# Altium project netv2mvp-dvt1.PrjPcb (part 2 of 2)

## Sheet 05io.SchDoc
size C
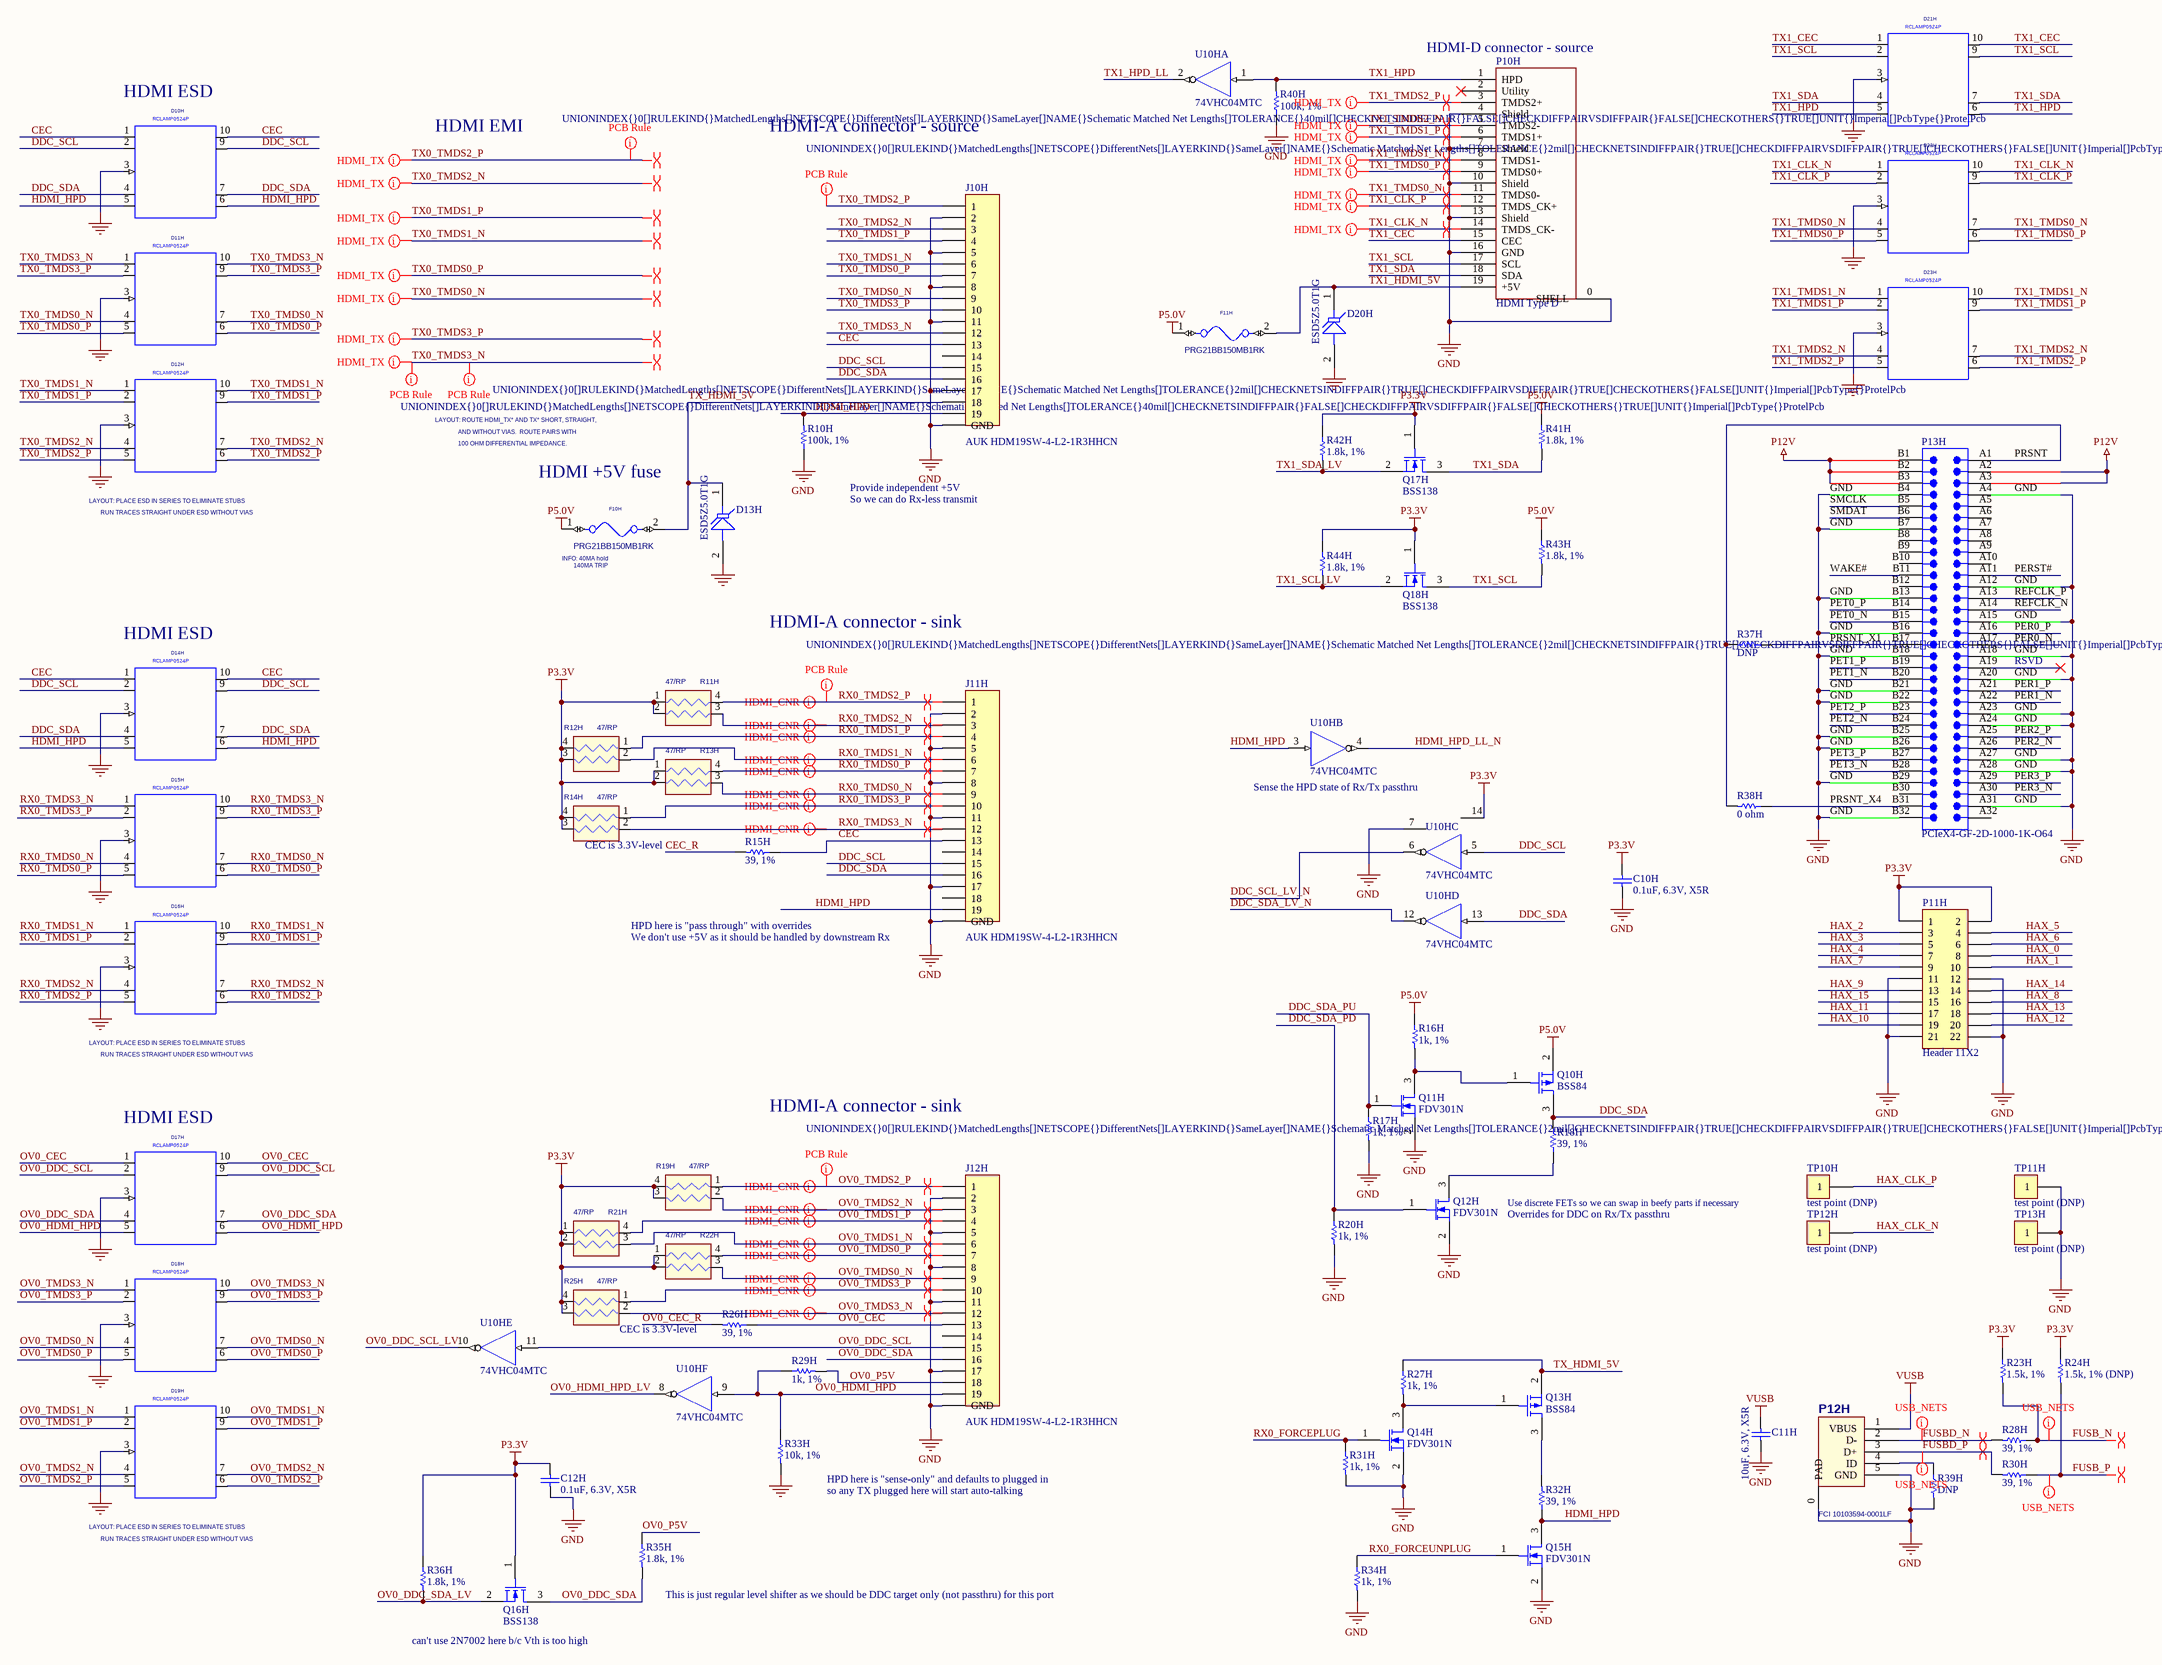
[diagram p5: 05io.SchDoc]

### Parts
C10H  0.1uF, 6.3V, X5R  [CAPC0603X03L]
C11H  10uF, 6.3V, X5R  [CAPC1608N]
C12H  0.1uF, 6.3V, X5R  [CAPC0603X03L]
D10H  RCLAMP0524P  [SEMTECH_SLP2510P8]  (value not drawn)
D11H  RCLAMP0524P  [SEMTECH_SLP2510P8]  (value not drawn)
D12H  RCLAMP0524P  [SEMTECH_SLP2510P8]  (value not drawn)
D13H  ESD5Z5.0T1G  [SOD-523]
D14H  RCLAMP0524P  [SEMTECH_SLP2510P8]  (value not drawn)
D15H  RCLAMP0524P  [SEMTECH_SLP2510P8]  (value not drawn)
D16H  RCLAMP0524P  [SEMTECH_SLP2510P8]  (value not drawn)
D17H  RCLAMP0524P  [SEMTECH_SLP2510P8]  (value not drawn)
D18H  RCLAMP0524P  [SEMTECH_SLP2510P8]  (value not drawn)
D19H  RCLAMP0524P  [SEMTECH_SLP2510P8]  (value not drawn)
D20H  ESD5Z5.0T1G  [SOD-523]
D21H  RCLAMP0524P  [SEMTECH_SLP2510P8]  (value not drawn)
D22H  RCLAMP0524P  [SEMTECH_SLP2510P8]  (value not drawn)
D23H  RCLAMP0524P  [SEMTECH_SLP2510P8]  (value not drawn)
F10H  PRG21BB150MB1RK  [RESC2012N]
F11H  PRG21BB150MB1RK  [RESC2012N]
J10H  AUK HDM19SW-4-L2-1R3HHCN  [MOLEX_47151-0001]
J11H  AUK HDM19SW-4-L2-1R3HHCN  [MOLEX_47151-0001]
J12H  AUK HDM19SW-4-L2-1R3HHCN  [MOLEX_47151-0001]
P10H  HDMI Type D  [MOLEX_0467651301]
P11H  Header 11X2  [HDR2X11]
P12H  FCI 10103594-0001LF  [USB_MICRO_B_SMT]
P13H  PCIeX4-GF-2D-1000-1K-O64  [PCIeX4-GF-2D-1000-1K-O64]  (no BOM)
Q10H  BSS84  [SOT23-3N]
Q11H  FDV301N  [SOT23-3N]
Q12H  FDV301N  [SOT23-3N]
Q13H  BSS84  [SOT23-3N]
Q14H  FDV301N  [SOT23-3N]
Q15H  FDV301N  [SOT23-3N]
Q16H  BSS138  [SOT23-3N]
Q17H  BSS138  [SOT23-3N]
Q18H  BSS138  [SOT23-3N]
R10H  100k, 1%  [RESC1005N]
R11H  47/RP  [PANASONIC_EXB24V]
R12H  47/RP  [PANASONIC_EXB24V]
R13H  47/RP  [PANASONIC_EXB24V]
R14H  47/RP  [PANASONIC_EXB24V]
R15H  39, 1%  [RESC1005N]
R16H  1k, 1%  [RESC1005N]
R17H  1k, 1%  [RESC1005N]
R18H  39, 1%  [RESC1005N]
R19H  47/RP  [PANASONIC_EXB24V]
R20H  1k, 1%  [RESC1005N]
R21H  47/RP  [PANASONIC_EXB24V]
R22H  47/RP  [PANASONIC_EXB24V]
R23H  1.5k, 1%  [RESC1005N]
R24H  1.5k, 1% (DNP)  [RESC1005N]
R25H  47/RP  [PANASONIC_EXB24V]
R26H  39, 1%  [RESC1005N]
R27H  1k, 1%  [RESC1005N]
R28H  39, 1%  [RESC1005N]
R29H  1k, 1%  [RESC1005N]
R30H  39, 1%  [RESC1005N]
R31H  1k, 1%  [RESC1005N]
R32H  39, 1%  [RESC1005N]
R33H  10k, 1%  [RESC1005N]
R34H  1k, 1%  [RESC1005N]
R35H  1.8k, 1%  [RESC1005N]
R36H  1.8k, 1%  [RESC1005N]
R37H  DNP  [RESC1005N]
R38H  0 ohm  [RESC1005N]
R39H  DNP  [RESC1005N]
R40H  100k, 1%  [RESC1005N]
R41H  1.8k, 1%  [RESC1005N]
R42H  1.8k, 1%  [RESC1005N]
R43H  1.8k, 1%  [RESC1005N]
R44H  1.8k, 1%  [RESC1005N]
TP10H  test point (DNP)  [TP_2MM_SQ]
TP11H  test point (DNP)  [TP_2MM_SQ]
TP12H  test point (DNP)  [TP_2MM_SQ]
TP13H  test point (DNP)  [TP_2MM_SQ]
U10H  74VHC04MTC  [TSOP65P640-14AN]  (parts A,B,C,D,E,F of 6)

### Nets
GND: C10H.2 C11H.2 C12H.2 D10H.3(GND1) D11H.3(GND1) D12H.3(GND1) D13H.2(A) D14H.3(GND1) D15H.3(GND1) D16H.3(GND1) D17H.3(GND1) D18H.3(GND1) D19H.3(GND1) D20H.2(A) D21H.3(GND1) D22H.3(GND1) D23H.3(GND1) J10H.0(GND) J10H.2 J10H.5 J10H.8 J10H.11 J10H.17 J11H.0(GND) J11H.2 J11H.5 J11H.8 J11H.11 J11H.17 J12H.0(GND) J12H.2 J12H.5 J12H.8 J12H.11 J12H.17 P10H.0(SHELL) P10H.4(Shield) P10H.7(Shield) P10H.10(Shield) P10H.13(Shield) P10H.16(GND) P11H.11 P11H.12 P11H.21 P11H.22 P12H.0(PAD) P12H.5(GND) P13H.A4 P13H.A12 P13H.A15 P13H.A18 P13H.A20 P13H.A23 P13H.A24 P13H.A27 P13H.A28 P13H.A31 P13H.B4 P13H.B7 P13H.B13 P13H.B16 P13H.B18 P13H.B21 P13H.B22 P13H.B25 P13H.B26 P13H.B29 P13H.B32 Q11H.2(S) Q12H.2(S) Q14H.2(S) Q15H.2(S) R10H.1 R17H.2 R20H.2 R31H.2 R33H.2 R34H.2 R39H.2 R40H.1 TP11H.1 TP13H.1 U10H.7(GND)
P3.3V: C10H.1 C12H.1 P11H.1 P11H.2 Q16H.1(G) Q17H.1(G) Q18H.1(G) R11H.1(R1) R11H.2(R2) R12H.3(R22) R12H.4(R12) R13H.1(R1) R13H.2(R2) R14H.3(R22) R14H.4(R12) R19H.3(R22) R19H.4(R12) R21H.1(R1) R21H.2(R2) R22H.1(R1) R22H.2(R2) R23H.1 R24H.1 R25H.3(R22) R25H.4(R12) R36H.1 R42H.1 R44H.1 U10H.14(P3.3V)
P5.0V: F10H.1 F11H.1 Q10H.2(S) R16H.1 R41H.1 R43H.1
P12V: P13H.A2 P13H.A3 P13H.B1 P13H.B2 P13H.B3
VUSB: C11H.1 P12H.1(VBUS)
CEC: D10H.1(IO1A) D10H.10(IO1B) D14H.1(IO1A) D14H.10(IO1B) J10H.13 J11H.13 R15H.1
CEC_R: R15H.2
DDC_SCL: D10H.2(IO2A) D10H.9(IO2B) D14H.2(IO2A) D14H.9(IO2B) J10H.15 J11H.15 U10H.5(A)
DDC_SCL_LV_N: U10H.6(~{O})
DDC_SDA: D10H.4(IO3A) D10H.7(IO3B) D14H.4(IO3A) D14H.7(IO3B) J10H.16 J11H.16 Q10H.3(D) R18H.2 U10H.13(A)
DDC_SDA_LV_N: U10H.12(~{O})
DDC_SDA_PD: Q12H.1(G) R20H.1
DDC_SDA_PU: Q11H.1(G) R17H.1
FUSB_N: R23H.2 R28H.1
FUSB_P: R24H.2 R30H.1
FUSBD_N: P12H.2(D-) R28H.2
FUSBD_P: P12H.3(D+) R30H.2
HAX_0: P11H.8
HAX_1: P11H.10
HAX_2: P11H.3
HAX_3: P11H.5
HAX_4: P11H.7
HAX_5: P11H.4
HAX_6: P11H.6
HAX_7: P11H.9
HAX_8: P11H.16
HAX_9: P11H.13
HAX_10: P11H.19
HAX_11: P11H.17
HAX_12: P11H.20
HAX_13: P11H.18
HAX_14: P11H.14
HAX_15: P11H.15
HAX_CLK_N: TP12H.1
HAX_CLK_P: TP10H.1
HDMI_HPD: D10H.5(IO4A) D10H.6(IO4B) D14H.5(IO4A) D14H.6(IO4B) J10H.19 J11H.19 Q15H.3(D) R10H.2 R32H.1 U10H.3(A)
HDMI_HPD_LL_N: U10H.4(~{O})
OV0_CEC: D17H.1(IO1A) D17H.10(IO1B) J12H.13 R26H.1
OV0_CEC_R: R26H.2
OV0_DDC_SCL: D17H.2(IO2A) D17H.9(IO2B) J12H.15 U10H.11(A)
OV0_DDC_SCL_LV: U10H.10(~{O})
OV0_DDC_SDA: D17H.4(IO3A) D17H.7(IO3B) J12H.16 Q16H.3(D) R35H.2
OV0_DDC_SDA_LV: Q16H.2(S) R36H.2
OV0_HDMI_HPD: D17H.5(IO4A) D17H.6(IO4B) J12H.19 R29H.1 R33H.1 U10H.9(A)
OV0_HDMI_HPD_LV: U10H.8(~{O})
OV0_P5V: J12H.18 R29H.2 R35H.1
OV0_TMDS0_N: D18H.4(IO3A) D18H.7(IO3B) J12H.9 R22H.3(R22)
OV0_TMDS0_P: D18H.5(IO4A) D18H.6(IO4B) J12H.7 R22H.4(R12)
OV0_TMDS1_N: D19H.1(IO1A) D19H.10(IO1B) J12H.6 R21H.3(R22)
OV0_TMDS1_P: D19H.2(IO2A) D19H.9(IO2B) J12H.4 R21H.4(R12)
OV0_TMDS2_N: D19H.4(IO3A) D19H.7(IO3B) J12H.3 R19H.2(R2)
OV0_TMDS2_P: D19H.5(IO4A) D19H.6(IO4B) J12H.1 R19H.1(R1)
OV0_TMDS3_N: D18H.1(IO1A) D18H.10(IO1B) J12H.12 R25H.2(R2)
OV0_TMDS3_P: D18H.2(IO2A) D18H.9(IO2B) J12H.10 R25H.1(R1)
PER0_N: P13H.A17
PER0_P: P13H.A16
PER1_N: P13H.A22
PER1_P: P13H.A21
PER2_N: P13H.A26
PER2_P: P13H.A25
PER3_N: P13H.A30
PER3_P: P13H.A29
PERST#: P13H.A11
PET0_N: P13H.B15
PET0_P: P13H.B14
PET1_N: P13H.B20
PET1_P: P13H.B19
PET2_N: P13H.B24
PET2_P: P13H.B23
PET3_N: P13H.B28
PET3_P: P13H.B27
PRSNT: P13H.A1 R37H.2 R38H.2
PRSNT_X1: P13H.B17 R37H.1
PRSNT_X4: P13H.B31 R38H.1
REFCLK_N: P13H.A14
REFCLK_P: P13H.A13
RX0_FORCEPLUG: Q14H.1(G) R31H.1
RX0_FORCEUNPLUG: Q15H.1(G) R34H.1
RX0_TMDS0_N: D15H.4(IO3A) D15H.7(IO3B) J11H.9 R13H.3(R22)
RX0_TMDS0_P: D15H.5(IO4A) D15H.6(IO4B) J11H.7 R13H.4(R12)
RX0_TMDS1_N: D16H.1(IO1A) D16H.10(IO1B) J11H.6 R12H.2(R2)
RX0_TMDS1_P: D16H.2(IO2A) D16H.9(IO2B) J11H.4 R12H.1(R1)
RX0_TMDS2_N: D16H.4(IO3A) D16H.7(IO3B) J11H.3 R11H.3(R22)
RX0_TMDS2_P: D16H.5(IO4A) D16H.6(IO4B) J11H.1 R11H.4(R12)
RX0_TMDS3_N: D15H.1(IO1A) D15H.10(IO1B) J11H.12 R14H.2(R2)
RX0_TMDS3_P: D15H.2(IO2A) D15H.9(IO2B) J11H.10 R14H.1(R1)
SMCLK: P13H.B5
SMDAT: P13H.B6
TX0_TMDS0_N: D11H.4(IO3A) D11H.7(IO3B) J10H.9
TX0_TMDS0_P: D11H.5(IO4A) D11H.6(IO4B) J10H.7
TX0_TMDS1_N: D12H.1(IO1A) D12H.10(IO1B) J10H.6
TX0_TMDS1_P: D12H.2(IO2A) D12H.9(IO2B) J10H.4
TX0_TMDS2_N: D12H.4(IO3A) D12H.7(IO3B) J10H.3
TX0_TMDS2_P: D12H.5(IO4A) D12H.6(IO4B) J10H.1
TX0_TMDS3_N: D11H.1(IO1A) D11H.10(IO1B) J10H.12
TX0_TMDS3_P: D11H.2(IO2A) D11H.9(IO2B) J10H.10
TX1_CEC: D21H.1(IO1A) D21H.10(IO1B) P10H.15(CEC)
TX1_CLK_N: D22H.1(IO1A) D22H.10(IO1B) P10H.14(TMDS_CK-)
TX1_CLK_P: D22H.2(IO2A) D22H.9(IO2B) P10H.12(TMDS_CK+)
TX1_HDMI_5V: D20H.1(K) F11H.2 P10H.19(+5V)
TX1_HPD: D21H.5(IO4A) D21H.6(IO4B) P10H.1(HPD) R40H.2 U10H.1(A)
TX1_HPD_LL: U10H.2(~{O})
TX1_SCL: D21H.2(IO2A) D21H.9(IO2B) P10H.17(SCL) Q18H.3(D) R43H.2
TX1_SCL_LV: Q18H.2(S) R44H.2
TX1_SDA: D21H.4(IO3A) D21H.7(IO3B) P10H.18(SDA) Q17H.3(D) R41H.2
TX1_SDA_LV: Q17H.2(S) R42H.2
TX1_TMDS0_N: D22H.4(IO3A) D22H.7(IO3B) P10H.11(TMDS0-)
TX1_TMDS0_P: D22H.5(IO4A) D22H.6(IO4B) P10H.9(TMDS0+)
TX1_TMDS1_N: D23H.1(IO1A) D23H.10(IO1B) P10H.8(TMDS1-)
TX1_TMDS1_P: D23H.2(IO2A) D23H.9(IO2B) P10H.6(TMDS1+)
TX1_TMDS2_N: D23H.4(IO3A) D23H.7(IO3B) P10H.5(TMDS2-)
TX1_TMDS2_P: D23H.5(IO4A) D23H.6(IO4B) P10H.3(TMDS2+)
TX_HDMI_5V: D13H.1(K) F10H.2 J10H.18 Q13H.2(S) R27H.1
WAKE#: P13H.B11
NetP12H_4: P12H.4(ID) R39H.1
NetQ10H_1: Q10H.1(G) Q11H.3(D) R16H.2
NetQ12H_3: Q12H.3(D) R18H.1
NetQ13H_1: Q13H.1(G) Q14H.3(D) R27H.2
NetQ13H_3: Q13H.3(D) R32H.2

Not connected (* = marked no-connect by the designer): J10H 14; J11H 14 18; J12H 14; P10H 2(Utility)*; P13H A5 A6 A7 A8 A9 A10 A19* A32 B8 B9 B10 B12 B30

### Layout directives
differential pair: FUSB_N, FUSB_P, FUSBD_N, FUSBD_P, OV0_TMDS0_N, OV0_TMDS0_P, OV0_TMDS1_N, OV0_TMDS1_P, OV0_TMDS2_N, OV0_TMDS2_P, OV0_TMDS3_N, OV0_TMDS3_P, RX0_TMDS0_N, RX0_TMDS0_P, RX0_TMDS1_N, RX0_TMDS1_P, RX0_TMDS2_N, RX0_TMDS2_P, RX0_TMDS3_N, RX0_TMDS3_P, TX0_TMDS0_N, TX0_TMDS0_P, TX0_TMDS1_N, TX0_TMDS1_P, TX0_TMDS2_N, TX0_TMDS2_P, TX0_TMDS3_N, TX0_TMDS3_P, TX1_CLK_N, TX1_CLK_P, TX1_TMDS0_N, TX1_TMDS0_P, TX1_TMDS1_N, TX1_TMDS1_P, TX1_TMDS2_N, TX1_TMDS2_P
net class HDMI_TX: TX0_TMDS0_N, TX0_TMDS0_P, TX0_TMDS1_N, TX0_TMDS1_P, TX0_TMDS2_N, TX0_TMDS2_P, TX0_TMDS3_N, TX0_TMDS3_P, TX1_CLK_N, TX1_CLK_P, TX1_TMDS0_N, TX1_TMDS0_P, TX1_TMDS1_N, TX1_TMDS1_P, TX1_TMDS2_N, TX1_TMDS2_P
rule Matched Net Lengths [Tolerance = 40mil]: TX0_TMDS2_P, TX0_TMDS3_N
rule Matched Net Lengths [Tolerance = 2mil]: OV0_TMDS2_P, RX0_TMDS2_P, TX0_TMDS2_P, TX0_TMDS3_N
net class HDMI_CNR: OV0_TMDS0_N, OV0_TMDS0_P, OV0_TMDS1_N, OV0_TMDS1_P, OV0_TMDS2_N, OV0_TMDS2_P, OV0_TMDS3_N, OV0_TMDS3_P, RX0_TMDS0_N, RX0_TMDS0_P, RX0_TMDS1_N, RX0_TMDS1_P, RX0_TMDS2_N, RX0_TMDS2_P, RX0_TMDS3_N, RX0_TMDS3_P
net class USB_NETS: FUSB_N, FUSB_P, FUSBD_N, FUSBD_P

### Notes on the sheet
- (near P10H) HDMI-D connector - source
- (near D10H) HDMI ESD
- HDMI EMI
- HDMI-A connector - source
- LAYOUT: ROUTE HDMI_TX* AND TX* SHORT, STRAIGHT,
- 100 OHM DIFFERENTIAL IMPEDANCE.
- AND WITHOUT VIAS.  ROUTE PAIRS WITH
- (near D12H) LAYOUT: PLACE ESD IN SERIES TO ELIMINATE STUBS
- RUN TRACES STRAIGHT UNDER ESD WITHOUT VIAS
- HDMI +5V fuse
- Provide independent +5V
- So we can do Rx-less transmit
- (near F10H) INFO: 40MA hold
- (near F10H) 140MA TRIP
- HDMI-A connector - sink
- (near D14H) HDMI ESD
- RSVD
- (near U10H) Sense the HPD state of Rx/Tx passthru
- (near R14H) CEC is 3.3V-level
- HPD here is "pass through" with overrides
- (near J11H) We don't use +5V as it should be handled by downstream Rx
- (near D16H) LAYOUT: PLACE ESD IN SERIES TO ELIMINATE STUBS
- (near D17H) HDMI ESD
- Use discrete FETs so we can swap in beefy parts if necessary
- Overrides for DDC on Rx/Tx passthru
- CEC is 3.3V-level
- HPD here is "sense-only" and defaults to plugged in
- so any TX plugged here will start auto-talking
- (near D19H) LAYOUT: PLACE ESD IN SERIES TO ELIMINATE STUBS
- (near R35H) This is just regular level shifter as we should be DDC target only (not passthru) for this port
- can't use 2N7002 here b/c Vth is too high

### Library data of the parts
C10H C12H = Cap Semi: Capacitor (Semiconductor SIM Model); MPN: CL03A104KQ3NNNC; VENDOR: Samsung; MYPN: C-104-6p3-X5R-0201
C11H = Cap Semi: Capacitor (Semiconductor SIM Model); MPN: CL10A106MQ8NNNC; VENDOR: Samsung; MYPN: C-106-6.3-X5R-0603
D10H D11H D12H D14H D15H D16H D17H D18H D19H D21H D22H D23H = RCLAMP0524P: PART_NUMBER: V00004-001; MPN: RCLAMP0524PATCT; CDS_LMAN_SYM_OUTLINE: -175,225,175,-175; MATERIAL: IC; PACK_TYPE: SLP1610P4; PATH: I24; OriginalSymbolOrigin: (-175,225); LOCATION: D8; XY: (-2475,4175); VER: 1; ROT: 0; PHYS_PAGE: 10; DRAWING: @BROWNSTONE_LIB.BROWNSTONE(SCH_1):PAGE10; CDS_LIB: integrated_circuits; VENDOR: Semtech; MYPN: D-RCLAMP0524PATCT; SEC_TYPE: SLP1610P4; SEC: 1; CDS_LOCATION: D8; $LOCATION: D8
D13H D20H = Tranzorb: On Semi 5.0V standoff TVS diode; VENDOR: On Semiconductor; MYPN: D-ESD5Z5.0T1G; Published: 24-Mar-1999; LatestRevisionDate: 17-Jul-2002; LatestRevisionNote: Re-released for DXP Platform.; PackageReference: DO-7; Publisher: Altium Limited; MPN: ESD5Z5.0T1G
F10H F11H = FUSE0805: Murata 140mA fuse, 40mA hold; PART_NUMBER: M00014-001; CDS_LMAN_SYM_OUTLINE: -75,50,75,-50; OriginalSymbolOrigin: (-125,50); LOCATION: F1; XY: (-4350,3000); VER: 1; ROT: 0; PHYS_PAGE: 10; PATH: I13; DRAWING: @BROWNSTONE_LIB.BROWNSTONE(SCH_1):PAGE10; CDS_LIB: fuses; SEC_TYPE: FUSE0805; SEC: 1; PACK_TYPE: FUSE0805; MATERIAL: FUSE; CDS_LOCATION: F1; $LOCATION: F1; MPN: PRG21BB150MB1RK; Vendor: Murata; MYPN: PRG21BB150MB1RK
J10H J11H J12H = Header 19: Molex HDMI connector, Type A; MYPN: J-HDMI-SMT-RA-A-MALE; LatestRevisionDate: 17-Jul-2002; LatestRevisionNote: Re-released for DXP Platform.; Publisher: Altium Limited; MPN: HDM19SW-4-L2-1R3HHCN; VENDOR: AUK
P10H = HDMI-TYPE-D: HDMI Type D with through-hole mounts; MPN: 0467651301; VENDOR: Molex; MYPN: J-HDMI-D-THMNT
P11H = Header 11X2: Header, 11-Pin, Dual row; LatestRevisionDate: 17-Jul-2002; LatestRevisionNote: Re-released for DXP Platform.; Publisher: Altium Limited
P12H = USB_MINI-AB_1: Micro USB B type connector; VENDOR: FCI/BERG; MYPN: J-MICROUSB-SMT-FCI; MPN: 10103594-0001LF
P13H = CMP-0001-00031-1: Golden finger, PCIeX4, Dual, Opposite, Pitch 1mm, 64-Position; Mating Connector: Molex-87715-9106; Datasheet Version: rev2.0, Apr-2007; Package Reference: PCIeX4-GF-2D-1000-1K-O64; ClassName: Edge Connector; Publisher: Altium
Q10H Q13H = MOSFET-P: P-Channel MOSFET; VENDOR: ON Semiconductor; MYPN: Q-BSS84; Published: 8-Jun-2000; LatestRevisionDate: 17-Jul-2002; LatestRevisionNote: Re-released for DXP Platform.; PackageVersion: 1995/1996; PackageReference: E3; Publisher: Altium Limited; PackageDescription: TO, Flat Index; 3 In-Line, Axial Leads; Body Dia. 4.6mm; Lead Dia. 0.5 mm (max); MPN: BSS84
Q11H Q12H Q14H Q15H = MOSFET-N: N-Channel MOSFET; VENDOR: ON Semiconductor; MYPN: Q-FDV301N; Published: 8-Jun-2000; LatestRevisionDate: 17-Jul-2002; LatestRevisionNote: Re-released for DXP Platform.; PackageVersion: 1995/1996; PackageReference: E3; Publisher: Altium Limited; MPN: FDV301N
Q16H Q17H Q18H = MOSFET-N: N-Channel MOSFET; MPN: BSS138LT1G; VENDOR: ON Semiconductor; MYPN: Q-BSS138LT1G; Published: 8-Jun-2000; LatestRevisionDate: 17-Jul-2002; LatestRevisionNote: Re-released for DXP Platform.; PackageVersion: 1995/1996; PackageReference: E3; Publisher: Altium Limited
R10H R40H = Res1: Resistor; VENDOR: ANY; MYPN: R-104-1P-1_16W-0402; MPN: ANY
R11H R12H R13H R14H R19H R21H R22H R25H = RPACK2: MPN: RP102PJ470CS; MFG: SAMSUNG; MYPN: RP-RP102PJ470CS
R15H R18H R26H R28H R30H R32H = Res1: Resistor; VENDOR: ANY; MYPN: R-390-1P-1_16W-0402; MPN: ANY
R16H R17H R20H R27H R29H R31H R34H = Res1: Resistor; MPN: RS02U102FT; VENDOR: Fenghua; MYPN: R-102-1P-1_16W-0402
R23H = Res1: Resistor; MPN: RS02U152FT; VENDOR: Fenghua; MYPN: R-152-1P-1_16W-0402
R24H = Res1: Resistor; VENDOR: Fenghua; MYPN: DNP; MPN: DNP
R33H = Res1: Resistor; MPN: RS02U103FT; VENDOR: Fenghua; MYPN: R-103-1P-1_16W-0402
R35H R36H R41H R42H R43H R44H = Res1: Resistor; MPN: RS02U182FT; Value: 100k; VENDOR: Fenghua; MYPN: R-182-1P-1_16W-0402; Published: 8-Jun-2000; LatestRevisionDate: 17-Jul-2002; LatestRevisionNote: Re-released for DXP Platform.; PackageReference: AXIAL-0.3; Publisher: Altium Limited
R37H R39H = Res1: Resistor; VENDOR: ANY; MYPN: DNP; MPN: ANY
R38H = Res1: Resistor; VENDOR: ANY; MYPN: R-0-1P-1_16W-0402; MPN: ANY
TP10H TP11H TP12H TP13H = CON1: Connector
U10H = 74AC04SC: Hex Inverter, 14-Pin SOIC, Commercial Grade; MPN: 74VHC04MTCX; IC_Technology: AC; VENDOR: ON Semiconductor; MYPN: U-74VHC04MTC; Published: 17-Jul-2002; LatestRevisionDate: 13-Apr-2006; LatestRevisionNote: IPC-7351 Footprint Added.; DatasheetVersion: Nov-1999; PackageVersion: 2000; PackageReference: M14A; Publisher: Altium Limited; PackageDescription: 14-Pin Small Outline Integrated Circuit 1.27 mm Pitch; Code_IPC: SOIC127P600-14; ComponentLink1Description: Manufacturer Link; ComponentLink1URL: http://www.fairchildsemi.com/; ComponentLink2Description: Datasheet; ComponentLink2URL: http://www.fairchildsemi.com/ds/74%2F74AC04.pdf

## Nets that join several sheets
GND: 01power (73 pins), 02config (29 pins), 03fpga (171 pins), 04ddr3 (85 pins), 05io (83 pins)
P1.0V: 01power (5 pins), 03fpga (36 pins)
P1.2VTT: 01power (C27P.1 U14P.A2), 03fpga (12 pins)
P1.5V_D: 01power (7 pins), 03fpga (26 pins), 04ddr3 (60 pins)
P1.8V: 01power (5 pins), 03fpga (16 pins)
P3.3V: 01power (8 pins), 02config (25 pins), 03fpga (57 pins), 05io (29 pins)
P5.0V: 01power (11 pins), 02config (P11C.1 P11C.3), 05io (6 pins)
P12V: 01power (6 pins), 05io (5 pins)
VTT: 01power (C30P.1 U15P.3 U15P.5), 04ddr3 (35 pins)
VTT_REF: 01power (C31P.1 U15P.6), 03fpga (8 pins), 04ddr3 (10 pins)
VUSB: 01power (R28P.2), 02config (P12C.1 R19C.2), 05io (C11H.1 P12H.1)
CEC_R: 03fpga (U10F.P20), 05io (R15H.2)
DDC_SCL_LV_N: 03fpga (U10F.T18), 05io (U10H.6)
DDC_SDA_LV_N: 03fpga (U10F.V18), 05io (U10H.12)
DDC_SDA_PD: 03fpga (U10F.F20), 05io (Q12H.1 R20H.1)
DDC_SDA_PU: 03fpga (U10F.G20), 05io (Q11H.1 R17H.1)
DDR3_A0: 03fpga (U10F.U6), 04ddr3 (RP12D.5 U10D.N3 U11D.N3)
DDR3_A1: 03fpga (U10F.V4), 04ddr3 (RP12D.7 U10D.P7 U11D.P7)
DDR3_A2: 03fpga (U10F.W5), 04ddr3 (RP12D.8 U10D.P3 U11D.P3)
DDR3_A3: 03fpga (U10F.V5), 04ddr3 (RP13D.7 U10D.N2 U11D.N2)
DDR3_A4: 03fpga (U10F.AA1), 04ddr3 (RP14D.5 U10D.P8 U11D.P8)
DDR3_A5: 03fpga (U10F.Y2), 04ddr3 (RP15D.7 U10D.P2 U11D.P2)
DDR3_A6: 03fpga (U10F.AB1), 04ddr3 (RP14D.7 U10D.R8 U11D.R8)
DDR3_A7: 03fpga (U10F.AB3), 04ddr3 (RP15D.6 U10D.R2 U11D.R2)
DDR3_A8: 03fpga (U10F.AB2), 04ddr3 (RP15D.5 U10D.T8 U11D.T8)
DDR3_A9: 03fpga (U10F.Y3), 04ddr3 (RP15D.8 U10D.R3 U11D.R3)
DDR3_A10: 03fpga (U10F.W6), 04ddr3 (RP10D.8 U10D.L7 U11D.L7)
DDR3_A11: 03fpga (U10F.Y1), 04ddr3 (RP13D.5 U10D.R7 U11D.R7)
DDR3_A12: 03fpga (U10F.V2), 04ddr3 (RP13D.6 U10D.N7 U11D.N7)
DDR3_A13: 03fpga (U10F.AA3), 04ddr3 (RP14D.6 U10D.T3 U11D.T3)
DDR3_BA0: 03fpga (U10F.U5), 04ddr3 (RP13D.8 U10D.M2 U11D.M2)
DDR3_BA1: 03fpga (U10F.W4), 04ddr3 (RP12D.6 U10D.N8 U11D.N8)
DDR3_BA2: 03fpga (U10F.V7), 04ddr3 (RP11D.6 U10D.M3 U11D.M3)
DDR3_CAS_N: 03fpga (U10F.Y7), 04ddr3 (RP10D.6 U10D.K3 U11D.K3)
DDR3_CK_N: 03fpga (U10F.R2), 04ddr3 (C51D.1 R13D.1 U10D.K7 U11D.K7)
DDR3_CK_P: 03fpga (U10F.R3), 04ddr3 (C51D.2 R12D.1 U10D.J7 U11D.J7)
DDR3_CKE: 03fpga (U10F.Y8), 04ddr3 (RP10D.7 U10D.K9 U11D.K9)
DDR3_CS0_N: 03fpga (U10F.V9), 04ddr3 (RP10D.5 U10D.L2 U11D.L2)
DDR3_DM0: 03fpga (U10F.G1), 04ddr3 (U11D.E7)
DDR3_DM1: 03fpga (U10F.H4), 04ddr3 (U11D.D3)
DDR3_DM2: 03fpga (U10F.M5), 04ddr3 (U10D.E7)
DDR3_DM3: 03fpga (U10F.L3), 04ddr3 (U10D.D3)
DDR3_DQ0: 03fpga (U10F.C2), 04ddr3 (U11D.E3)
DDR3_DQ1: 03fpga (U10F.F1), 04ddr3 (U11D.F7)
DDR3_DQ2: 03fpga (U10F.B1), 04ddr3 (U11D.F2)
DDR3_DQ3: 03fpga (U10F.F3), 04ddr3 (U11D.F8)
DDR3_DQ4: 03fpga (U10F.A1), 04ddr3 (U11D.H3)
DDR3_DQ5: 03fpga (U10F.D2), 04ddr3 (U11D.H8)
DDR3_DQ6: 03fpga (U10F.B2), 04ddr3 (U11D.G2)
DDR3_DQ7: 03fpga (U10F.E2), 04ddr3 (U11D.H7)
DDR3_DQ8: 03fpga (U10F.J5), 04ddr3 (U11D.D7)
DDR3_DQ9: 03fpga (U10F.H3), 04ddr3 (U11D.C3)
DDR3_DQ10: 03fpga (U10F.K1), 04ddr3 (U11D.C8)
DDR3_DQ11: 03fpga (U10F.H2), 04ddr3 (U11D.C2)
DDR3_DQ12: 03fpga (U10F.J1), 04ddr3 (U11D.A7)
DDR3_DQ13: 03fpga (U10F.G2), 04ddr3 (U11D.A2)
DDR3_DQ14: 03fpga (U10F.H5), 04ddr3 (U11D.B8)
DDR3_DQ15: 03fpga (U10F.G3), 04ddr3 (U11D.A3)
DDR3_DQ16: 03fpga (U10F.N2), 04ddr3 (U10D.E3)
DDR3_DQ17: 03fpga (U10F.M6), 04ddr3 (U10D.F7)
DDR3_DQ18: 03fpga (U10F.P1), 04ddr3 (U10D.F2)
DDR3_DQ19: 03fpga (U10F.N5), 04ddr3 (U10D.F8)
DDR3_DQ20: 03fpga (U10F.P2), 04ddr3 (U10D.H3)
DDR3_DQ21: 03fpga (U10F.N4), 04ddr3 (U10D.H8)
DDR3_DQ22: 03fpga (U10F.R1), 04ddr3 (U10D.G2)
DDR3_DQ23: 03fpga (U10F.P6), 04ddr3 (U10D.H7)
DDR3_DQ24: 03fpga (U10F.K3), 04ddr3 (U10D.D7)
DDR3_DQ25: 03fpga (U10F.M2), 04ddr3 (U10D.C3)
DDR3_DQ26: 03fpga (U10F.K4), 04ddr3 (U10D.C8)
DDR3_DQ27: 03fpga (U10F.M3), 04ddr3 (U10D.C2)
DDR3_DQ28: 03fpga (U10F.J6), 04ddr3 (U10D.A7)
DDR3_DQ29: 03fpga (U10F.L5), 04ddr3 (U10D.A2)
DDR3_DQ30: 03fpga (U10F.J4), 04ddr3 (U10D.B8)
DDR3_DQ31: 03fpga (U10F.K6), 04ddr3 (U10D.A3)
DDR3_DQS0_N: 03fpga (U10F.D1), 04ddr3 (U11D.G3)
DDR3_DQS0_P: 03fpga (U10F.E1), 04ddr3 (U11D.F3)
DDR3_DQS1_N: 03fpga (U10F.J2), 04ddr3 (U11D.B7)
DDR3_DQS1_P: 03fpga (U10F.K2), 04ddr3 (U11D.C7)
DDR3_DQS2_N: 03fpga (U10F.P4), 04ddr3 (U10D.G3)
DDR3_DQS2_P: 03fpga (U10F.P5), 04ddr3 (U10D.F3)
DDR3_DQS3_N: 03fpga (U10F.L1), 04ddr3 (U10D.B7)
DDR3_DQS3_P: 03fpga (U10F.M1), 04ddr3 (U10D.C7)
DDR3_ODT0: 03fpga (U10F.W9), 04ddr3 (RP11D.7 U10D.K1 U11D.K1)
DDR3_RAS_N: 03fpga (U10F.Y9), 04ddr3 (RP11D.8 U10D.J3 U11D.J3)
DDR3_RESET_N: 03fpga (U10F.AB5), 04ddr3 (R11D.2 U10D.T2 U11D.T2)
DDR3_WE_N: 03fpga (U10F.V8), 04ddr3 (RP11D.5 U10D.L3 U11D.L3)
FPGA_DONE: 02config (U11C.36), 03fpga (R14F.1 U10F.G11)
FPGA_INIT: 02config (U11C.41), 03fpga (R13F.1 U10F.U12)
FPGA_MODE: 02config (U11C.35), 03fpga (P10F.1 R15F.2 U10F.U9)
FPGA_PROGRAM_B: 02config (R24C.1 U11C.42), 03fpga (R12F.1 U10F.N12)
FPGA_SPI_CS: 02config (R10C.2 U10C.1), 03fpga (U10F.T19)
FPGA_SPI_MISO_D1: 02config (U10C.2), 03fpga (U10F.R22)
FPGA_SPI_MOSI_D0: 02config (U10C.5), 03fpga (U10F.P22)
FPGA_SPI_RES_D3: 02config (R11C.2 U10C.7), 03fpga (U10F.R21)
FPGA_SPI_SCK: 02config (U10C.6), 03fpga (U10F.L12)
FPGA_SPI_WP_D2: 02config (R12C.2 U10C.3), 03fpga (U10F.P21)
FPGA_TCK: 02config (P11C.8 U11C.62), 03fpga (U10F.V12)
FPGA_TDI: 02config (P11C.14 U11C.63), 03fpga (U10F.R13)
FPGA_TDO: 02config (P11C.16 U11C.64), 03fpga (U10F.U13)
FPGA_TMS: 02config (P11C.12 U11C.61), 03fpga (U10F.T13)
FUSB_N: 03fpga (U10F.C15), 05io (R23H.2 R28H.1)
FUSB_P: 03fpga (U10F.C14), 05io (R24H.2 R30H.1)
HAX_0: 03fpga (U10F.B15), 05io (P11H.8)
HAX_1: 03fpga (U10F.B16), 05io (P11H.10)
HAX_2: 03fpga (U10F.B13), 05io (P11H.3)
HAX_3: 03fpga (U10F.A15), 05io (P11H.5)
HAX_4: 03fpga (U10F.A16), 05io (P11H.7)
HAX_5: 03fpga (U10F.A13), 05io (P11H.4)
HAX_6: 03fpga (U10F.A14), 05io (P11H.6)
HAX_7: 03fpga (U10F.B17), 05io (P11H.9)
HAX_8: 03fpga (U10F.B18), 05io (P11H.16)
HAX_9: 03fpga (U10F.C17), 05io (P11H.13)
HAX_10: 03fpga (U10F.C18), 05io (P11H.19)
HAX_11: 03fpga (U10F.C19), 05io (P11H.17)
HAX_12: 03fpga (U10F.B20), 05io (P11H.20)
HAX_13: 03fpga (U10F.A20), 05io (P11H.18)
HAX_14: 03fpga (U10F.A18), 05io (P11H.14)
HAX_15: 03fpga (U10F.A19), 05io (P11H.15)
HAX_CLK_N: 03fpga (U10F.E6), 05io (TP12H.1)
HAX_CLK_P: 03fpga (U10F.F6), 05io (TP10H.1)
HDMI_HPD_LL_N: 03fpga (U10F.U17), 05io (U10H.4)
I2C0_SCL: 02config (R21C.1 U11C.37), 03fpga (U10F.F13)
I2C0_SDA: 02config (R22C.1 U11C.38), 03fpga (U10F.F14)
MCU_INT0: 02config (U11C.2), 03fpga (U10F.D15)
MCU_INT1: 02config (U11C.43), 03fpga (U10F.G13)
OV0_CEC_R: 03fpga (U10F.P19), 05io (R26H.2)
OV0_DDC_SCL_LV: 03fpga (U10F.W17), 05io (U10H.10)
OV0_DDC_SDA_LV: 03fpga (U10F.R17), 05io (Q16H.2 R36H.2)
OV0_HDMI_HPD_LV: 03fpga (U10F.V17), 05io (U10H.8)
OV0_TMDS0_N: 03fpga (U10F.AB18), 05io (D18H.4 D18H.7 J12H.9 R22H.3)
OV0_TMDS0_P: 03fpga (U10F.AA18), 05io (D18H.5 D18H.6 J12H.7 R22H.4)
OV0_TMDS1_N: 03fpga (U10F.AA19), 05io (D19H.1 D19H.10 J12H.6 R21H.3)
OV0_TMDS1_P: 03fpga (U10F.AB20), 05io (D19H.2 D19H.9 J12H.4 R21H.4)
OV0_TMDS2_N: 03fpga (U10F.AB21), 05io (D19H.4 D19H.7 J12H.3 R19H.2)
OV0_TMDS2_P: 03fpga (U10F.AB22), 05io (D19H.5 D19H.6 J12H.1 R19H.1)
OV0_TMDS3_N: 03fpga (U10F.Y18), 05io (D18H.1 D18H.10 J12H.12 R25H.2)
OV0_TMDS3_P: 03fpga (U10F.Y19), 05io (D18H.2 D18H.9 J12H.10 R25H.1)
PER0_N: 03fpga (C25F.1), 05io (P13H.A17)
PER0_P: 03fpga (C24F.1), 05io (P13H.A16)
PER1_N: 03fpga (C36F.1), 05io (P13H.A22)
PER1_P: 03fpga (C27F.1), 05io (P13H.A21)
PER2_N: 03fpga (C40F.1), 05io (P13H.A26)
PER2_P: 03fpga (C37F.1), 05io (P13H.A25)
PER3_N: 03fpga (C22F.1), 05io (P13H.A30)
PER3_P: 03fpga (C20F.1), 05io (P13H.A29)
PERST#: 03fpga (U10F.E18), 05io (P13H.A11)
PET0_N: 03fpga (U10F.C11), 05io (P13H.B15)
PET0_P: 03fpga (U10F.D11), 05io (P13H.B14)
PET1_N: 03fpga (U10F.A10), 05io (P13H.B20)
PET1_P: 03fpga (U10F.B10), 05io (P13H.B19)
PET2_N: 03fpga (U10F.C9), 05io (P13H.B24)
PET2_P: 03fpga (U10F.D9), 05io (P13H.B23)
PET3_N: 03fpga (U10F.A8), 05io (P13H.B28)
PET3_P: 03fpga (U10F.B8), 05io (P13H.B27)
REFCLK_N: 03fpga (C23F.2), 05io (P13H.A14)
REFCLK_P: 03fpga (C21F.2), 05io (P13H.A13)
RX0_FORCEPLUG: 03fpga (U10F.N22), 05io (Q14H.1 R31H.1)
RX0_FORCEUNPLUG: 03fpga (U10F.M22), 05io (Q15H.1 R34H.1)
RX0_TMDS0_N: 03fpga (U10F.K21), 05io (D15H.4 D15H.7 J11H.9 R13H.3)
RX0_TMDS0_P: 03fpga (U10F.K22), 05io (D15H.5 D15H.6 J11H.7 R13H.4)
RX0_TMDS1_N: 03fpga (U10F.J20), 05io (D16H.1 D16H.10 J11H.6 R12H.2)
RX0_TMDS1_P: 03fpga (U10F.J21), 05io (D16H.2 D16H.9 J11H.4 R12H.1)
RX0_TMDS2_N: 03fpga (U10F.J22), 05io (D16H.4 D16H.7 J11H.3 R11H.3)
RX0_TMDS2_P: 03fpga (U10F.H22), 05io (D16H.5 D16H.6 J11H.1 R11H.4)
RX0_TMDS3_N: 03fpga (U10F.L19), 05io (D15H.1 D15H.10 J11H.12 R14H.2)
RX0_TMDS3_P: 03fpga (U10F.L20), 05io (D15H.2 D15H.9 J11H.10 R14H.1)
SMCLK: 03fpga (U10F.D19), 05io (P13H.B5)
SMDAT: 03fpga (U10F.D20), 05io (P13H.B6)
TX0_TMDS0_N: 03fpga (U10F.W22), 05io (D11H.4 D11H.7 J10H.9)
TX0_TMDS0_P: 03fpga (U10F.W21), 05io (D11H.5 D11H.6 J10H.7)
TX0_TMDS1_N: 03fpga (U10F.V20), 05io (D12H.1 D12H.10 J10H.6)
TX0_TMDS1_P: 03fpga (U10F.U20), 05io (D12H.2 D12H.9 J10H.4)
TX0_TMDS2_N: 03fpga (U10F.U21), 05io (D12H.4 D12H.7 J10H.3)
TX0_TMDS2_P: 03fpga (U10F.T21), 05io (D12H.5 D12H.6 J10H.1)
TX0_TMDS3_N: 03fpga (U10F.W19), 05io (D11H.1 D11H.10 J10H.12)
TX0_TMDS3_P: 03fpga (U10F.W20), 05io (D11H.2 D11H.9 J10H.10)
TX1_CEC: 03fpga (U10F.P17), 05io (D21H.1 D21H.10 P10H.15)
TX1_CLK_N: 03fpga (U10F.G21), 05io (D22H.1 D22H.10 P10H.14)
TX1_CLK_P: 03fpga (U10F.G22), 05io (D22H.2 D22H.9 P10H.12)
TX1_HPD_LL: 03fpga (U10F.U18), 05io (U10H.2)
TX1_SCL_LV: 03fpga (U10F.P16), 05io (Q18H.2 R44H.2)
TX1_SDA_LV: 03fpga (U10F.R16), 05io (Q17H.2 R42H.2)
TX1_TMDS0_N: 03fpga (U10F.E22), 05io (D22H.4 D22H.7 P10H.11)
TX1_TMDS0_P: 03fpga (U10F.D22), 05io (D22H.5 D22H.6 P10H.9)
TX1_TMDS1_N: 03fpga (U10F.C22), 05io (D23H.1 D23H.10 P10H.8)
TX1_TMDS1_P: 03fpga (U10F.B22), 05io (D23H.2 D23H.9 P10H.6)
TX1_TMDS2_N: 03fpga (U10F.B21), 05io (D23H.4 D23H.7 P10H.5)
TX1_TMDS2_P: 03fpga (U10F.A21), 05io (D23H.5 D23H.6 P10H.3)
UART0_RX: 02config (P11C.7 R25C.1 U11C.39), 03fpga (U10F.E13)
UART0_TX: 02config (P11C.9 R26C.1 U11C.40), 03fpga (U10F.E14)
WAKE#: 03fpga (U10F.E19), 05io (P13H.B11)